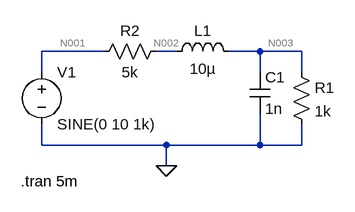
[diagram p0: schematic Lab1_part2.asc]
Lab1_part2.asc, the LTspice schematic file:
Version 4
SHEET 1 880 680
WIRE 16 128 -80 128
WIRE 128 128 96 128
WIRE 256 128 208 128
WIRE 320 128 256 128
WIRE -80 160 -80 128
WIRE 256 160 256 128
WIRE 320 160 320 128
WIRE -80 272 -80 240
WIRE 112 272 -80 272
WIRE 256 272 256 224
WIRE 256 272 112 272
WIRE 320 272 320 240
WIRE 320 272 256 272
WIRE 112 304 112 272
FLAG 112 304 0
SYMBOL voltage -80 144 R0
WINDOW 123 0 0 Left 2
WINDOW 39 0 0 Left 2
SYMATTR Value2 ""
SYMATTR SpiceLine ""
SYMATTR InstName V1
SYMATTR Value SINE(0 10 1k)
SYMBOL res 304 144 R0
SYMATTR InstName R1
SYMATTR Value 1k
SYMBOL cap 240 160 R0
SYMATTR InstName C1
SYMATTR Value 1n
SYMATTR SpiceLine ""
SYMBOL res 0 144 R270
WINDOW 0 32 56 VTop 2
WINDOW 3 0 56 VBottom 2
SYMATTR InstName R2
SYMATTR Value 5k
SYMBOL ind 112 144 R270
WINDOW 0 32 56 VTop 2
WINDOW 3 5 56 VBottom 2
SYMATTR InstName L1
SYMATTR Value 10µ
TEXT -112 328 Left 2 !.tran 5m

The netlist it stands for:
* Lab1_part2.asc
V1 N001 0 SINE(0 10 1k)
R1 N003 0 1k
C1 N003 0 1n
R2 N001 N002 5k
L1 N002 N003 10µ
.tran 5m
.backanno
.end

* Results of the author's LTspice run, read from the files saved beside the schematic
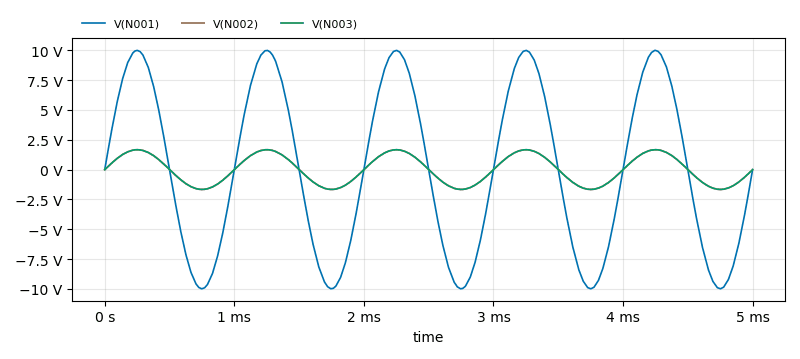
[diagram p1: Transient Analysis of Lab1_part2.asc, plotted from the saved traces]
* Transient Analysis, 1 run:
*   V(N001): min -9.997 V, max 9.998 V, average -674.5 µV, rms 7.068 V, last 0 V
*   V(N002): min -1.666 V, max 1.666 V, average -110.9 µV, rms 1.178 V, last -8.639 mV
*   V(N003): min -1.666 V, max 1.666 V, average -110.9 µV, rms 1.178 V, last -8.744 mV